# Altium schematic sheet periphrial.SchDoc
size A4
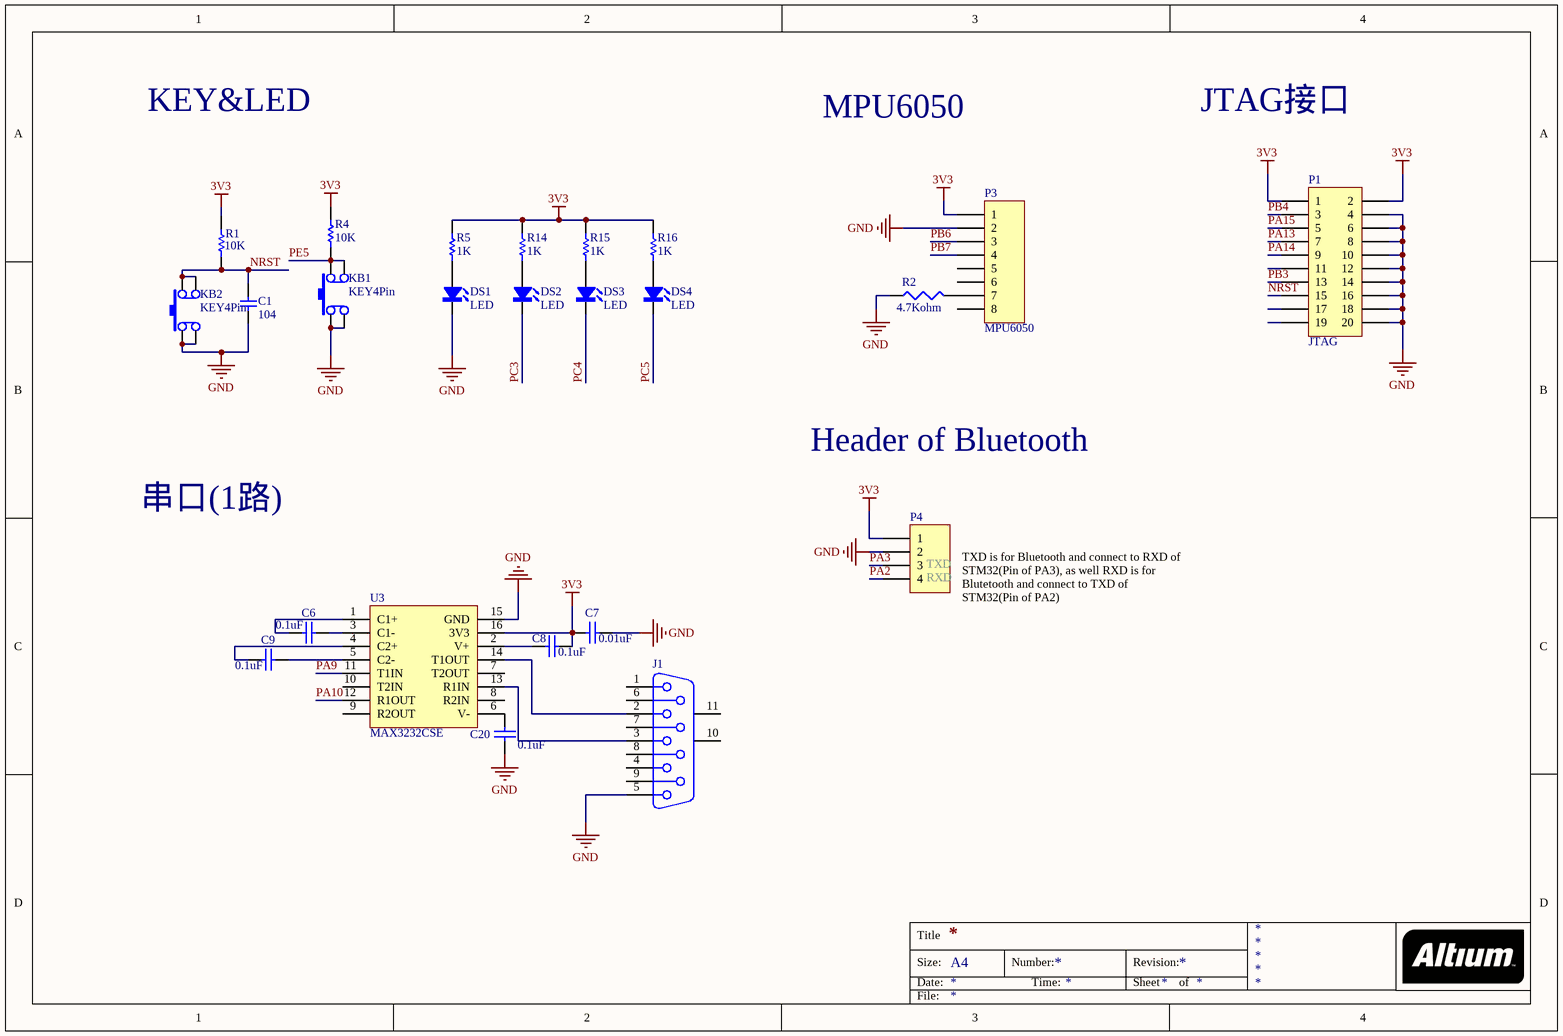
[diagram p0: periphrial.SchDoc]

## Parts
C1  104  [1608[0603]]
C6  value 0.1uF  [1608[0603]]  (hidden comment: Cap)
C7  value 0.01uF  [1608[0603]]  (hidden comment: Cap)
C8  value 0.1uF  [1608[0603]]  (hidden comment: Cap)
C9  value 0.1uF  [1608[0603]]  (hidden comment: Cap)
C20  value 0.1uF  [1608[0603]]  (hidden comment: Cap)
DS1  LED  [0805D]
DS2  LED  [0805D]
DS3  LED  [0805D]
DS4  LED  [0805D]
J1  D Connector 9  [DSUB1.385-2H9]  (value not drawn)
KB1  KEY4Pin  [KEY4Pin]
KB2  KEY4Pin  [KEY4Pin]
P1  JTAG  [HDR2X10]
P3  MPU6050  [HDR1X8]
P4  bluetooth1  [HDR1X4]  (value not drawn)
R1  value 10K  [J1-0603]  (hidden comment: Res1)
R2  value 4.7Kohm  [J1-0603]  (hidden comment: Res1)
R4  value 10K  [J1-0603]  (hidden comment: Res1)
R5  value 1K  [J1-0603]  (hidden comment: Res1)
R14  value 1K  [J1-0603]  (hidden comment: Res1)
R15  value 1K  [J1-0603]  (hidden comment: Res1)
R16  value 1K  [J1-0603]  (hidden comment: Res1)
U3  MAX3232CSE  [MAX3232CSE]

## Nets
3V3: C7.1 C8.1 P1.1 P1.2 P3.1 P4.1 R1.2 R4.2 R5.2 R14.2 R15.2 R16.2 U3.16(3V3)
GND: C1.1 C7.2 C20.2 DS1.K J1.5 KB1.1(T1) KB1.2(T2) KB2.1(T1) KB2.2(T2) P1.4 P1.6 P1.8 P1.10 P1.12 P1.14 P1.16 P1.18 P1.20 P3.2 P4.2 R2.1 U3.15(GND)
NRST: C1.2 KB2.3(T3) KB2.4(T4) P1.15 R1.1
PA2: P4.4
PA3: P4.3
PA9: U3.11(T1IN)
PA10: U3.12(R1OUT)
PA13: P1.7
PA14: P1.9
PA15: P1.5
PB3: P1.13
PB4: P1.3
PB6: P3.3
PB7: P3.4
PC3: DS2.K
PC4: DS3.K
PC5: DS4.K
PE5: KB1.3(T3) KB1.4(T4) R4.1
NetC6_1: C6.1 U3.1(C1+)
NetC6_2: C6.2 U3.3(C1-)
NetC8_2: C8.2 U3.2(V+)
NetC9_1: C9.1 U3.4(C2+)
NetC9_2: C9.2 U3.5(C2-)
NetC20_1: C20.1 U3.6(V-)
NetDS1_A: DS1.A R5.1
NetDS2_A: DS2.A R14.1
NetDS3_A: DS3.A R15.1
NetDS4_A: DS4.A R16.1
NetJ1_2: J1.2 U3.14(T1OUT)
NetJ1_3: J1.3 U3.13(R1IN)
NetP3_7: P3.7 R2.2

Not connected (* = marked no-connect by the designer): J1 1 4 6 7 8 9 10(MH1) 11(MH2); P1 11 17 19; P3 5 6 8; U3 7(T2OUT) 8(R2IN) 9(R2OUT) 10(T2IN)

## Notes on the sheet
- KEY&LED
- JTAG接口
- MPU6050
- 串口(1路)
- Header of Bluetooth
- (near P4) TXD
- (near P4) RXD
- (near P4) TXD is for Bluetooth and connect to RXD of STM32(Pin of PA3), as well RXD is for Blutetooth and connect to TXD of STM32(Pin of PA2)
- Title
- Size:
- Date:
- A4
- Number:
- Time:
- Revision:
- Sheet
- of
- File:

## Library data of the parts
C1 = CAP: Ceramic Capacitor
C6-C9 C20 = Cap: Capacitor; Published: 8-Jun-2000; LatestRevisionDate: 17-Jul-2002; LatestRevisionNote: Re-released for DXP Platform.; PackageReference: RAD-0.3; Publisher: Altium Limited
J1 = D Connector 9: Receptacle Assembly, 9 Position, Right Angle; PackageDocument: O; Positions: 9; Published: 15-Jun-2001; LatestRevisionDate: 17-Jul-2002; LatestRevisionNote: Re-released for DXP Platform.; DatasheetDocument: 1-Sep-1999; PackageReference: 788750; Publisher: Altium Limited; Orientation: Right Angle; Gender: Receptacle
KB1 KB2 = KEY4Pin: pin to pad: 2>4 4>2; REV: *; REF: *; DESIG: *; BOI: *; FAB: *; DEV: *; VAL: *
P1 = Header 10X2: Header, 10-Pin, Dual row; LatestRevisionDate: 17-Jul-2002; LatestRevisionNote: Re-released for DXP Platform.; Publisher: Altium Limited
P3 = Header 8: Header, 8-Pin; LatestRevisionDate: 17-Jul-2002; LatestRevisionNote: Re-released for DXP Platform.; Publisher: Altium Limited
P4 = Header 4: Header, 4-Pin; LatestRevisionDate: 17-Jul-2002; LatestRevisionNote: Re-released for DXP Platform.; Publisher: Altium Limited
R1 R4 R5 R14-R16 = Res1: Resistor; Published: 8-Jun-2000; LatestRevisionDate: 17-Jul-2002; LatestRevisionNote: Re-released for DXP Platform.; PackageReference: AXIAL-0.3; Publisher: Altium Limited; PackageDescription: Axial Device, Thru-Hole; 2 Leads; 0.3 in Pin Spacing
R2 = Res3: Resistor; Published: 8-Jun-2000; LatestRevisionDate: 04-Mar-2005; LatestRevisionNote: PCB Footprint replaced.; PackageReference: J1-0603; Publisher: Altium Limited